# Altium schematic sheet RS232&IrDA.SchDoc: RS232 & IrDA
size A4; DocumentNumber: MB1165; Revision: C.1; SheetNumber: 10; SheetTotal: 17; Project: STM32469I-EVAL
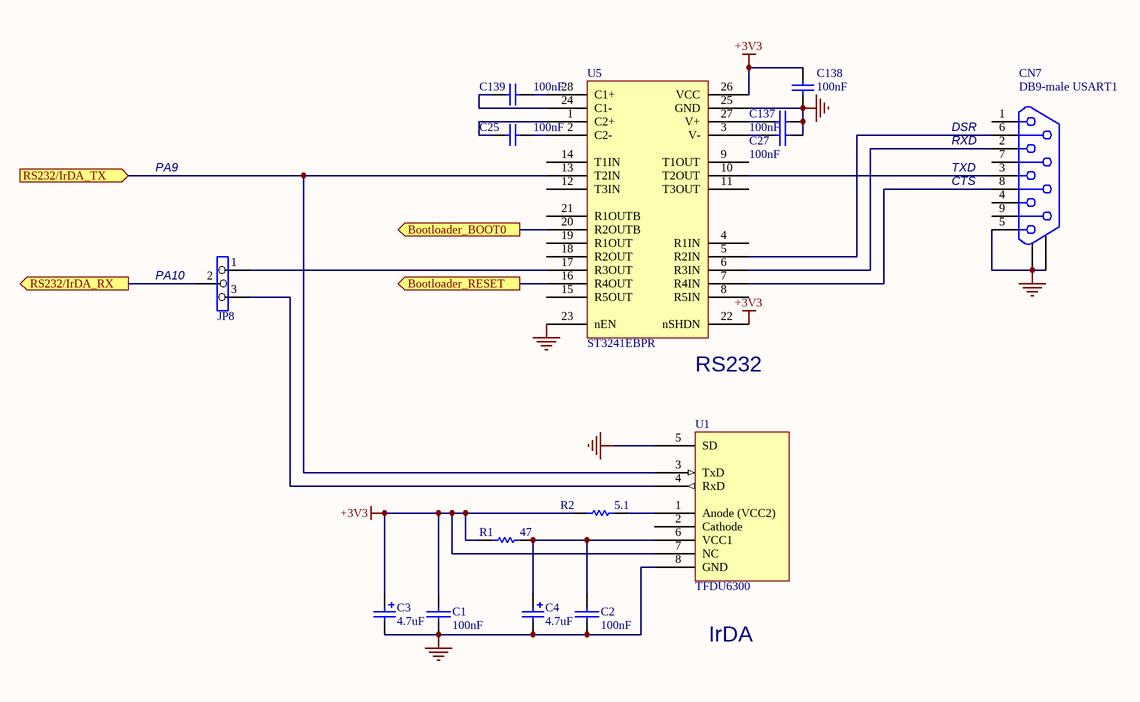
[diagram p0: RS232&IrDA.SchDoc]

## Parts
C1  100nF  [0603C]
C2  100nF  [0603C]
C3  4.7uF  [TAN-A]
C4  4.7uF  [TAN-A]
C25  100nF  [0603C]
C27  100nF  [0603C]
C137  100nF  [0603C]
C138  100nF  [0603C]
C139  100nF  [0603C]
CN7  DB9-male USART1  [DB9/M]
JP8  (no value)  [SIP3]
R1  47  [0603R]
R2  5.1  [0603R]
U1  TFDU6300  [IR_VISHAY3]
U5  ST3241EBPR  [SSOP28_0R65_10R2X7R8]

## Ports
Bootloader_BOOT0 (out), Bootloader_RESET (out), RS232/IrDA_RX (out), RS232/IrDA_TX (in)

## Nets
+3V3: C1.1 C3.1 C138.1 R1.1 R2.1 U1.7(NC) U5.22(nSHDN) U5.26(VCC)
GND: C1.2 C2.2 C3.2 C4.2 C27.1 C137.1 C138.2 CN7.5 CN7.10 CN7.11 U1.5(SD) U1.8(GND) U5.23(nEN) U5.25(GND)
Bootloader_BOOT0: U5.20(R2OUTB) ; port Bootloader_BOOT0
Bootloader_RESET: U5.16(R4OUT) ; port Bootloader_RESET
RS232/IrDA_RX: JP8.2 ; port RS232/IrDA_RX
RS232/IrDA_TX: U1.3(TxD) U5.13(T2IN) ; port RS232/IrDA_TX
NetC2_1: C2.1 C4.1 R1.2 U1.6(VCC1)
NetC25_1: C25.1 U5.1(C2+)
NetC25_2: C25.2 U5.2(C2-)
NetC27_2: C27.2 U5.3(V-)
NetC137_2: C137.2 U5.27(V+)
NetC139_1: C139.1 U5.24(C1-)
NetC139_2: C139.2 U5.28(C1+)
NetCN7_2: CN7.2 U5.6(R3IN)
NetCN7_3: CN7.3 U5.10(T2OUT)
NetCN7_6: CN7.6 U5.5(R2IN)
NetCN7_8: CN7.8 U5.7(R4IN)
NetJP8_1: JP8.1 U5.17(R3OUT)
NetJP8_3: JP8.3 U1.4(RxD)
NetR2_2: R2.2 U1.1(Anode_(VCC2))

Not connected (* = marked no-connect by the designer): CN7 1 4 7 9; U1 2(Cathode); U5 4(R1IN) 8(R5IN) 9(T1OUT) 11(T3OUT) 12(T3IN) 14(T1IN) 15(R5OUT) 18(R2OUT) 19(R1OUT) 21(R1OUTB)

## Notes on the sheet
- PA9
- (near CN7) RXD
- (near CN7) TXD
- (near CN7) DSR
- (near CN7) CTS
- (near JP8) PA10
- (near U5) RS232
- IrDA
- Title:
- Project:
- Size:
- Date:
- A4
- Reference:
- Sheet:
- Revision:
- of

## Library data of the parts
C1 C2 = CAP: Capacitor
C3 C4 = Cap Pol1: Polarized Capacitor (Radial); Value: 100pF; Published: 8-Jun-2000; Revision: July-2002: Re-released for DXP Platform.; Publisher: Altium Limited
C25 C27 C137-C139 = Cap: Capacitor; Value: 10nF; Published: 8-Jun-2000; Revision: July-2002: Re-released for DXP Platform.; Publisher: Altium Limited
CN7 = DB9-USART
JP8 = Jumper3
R1 R2 = Res1: Resistor; Value: 1K; Published: 8-Jun-2000; Revision: July-2002: Re-released for DXP Platform.; Publisher: Altium Limited
U1 = TFDU4300
U5 = ST3241